# EasyEDA Pro project ProPrj_Anniversary_2026-05-06.epro, board PCB1
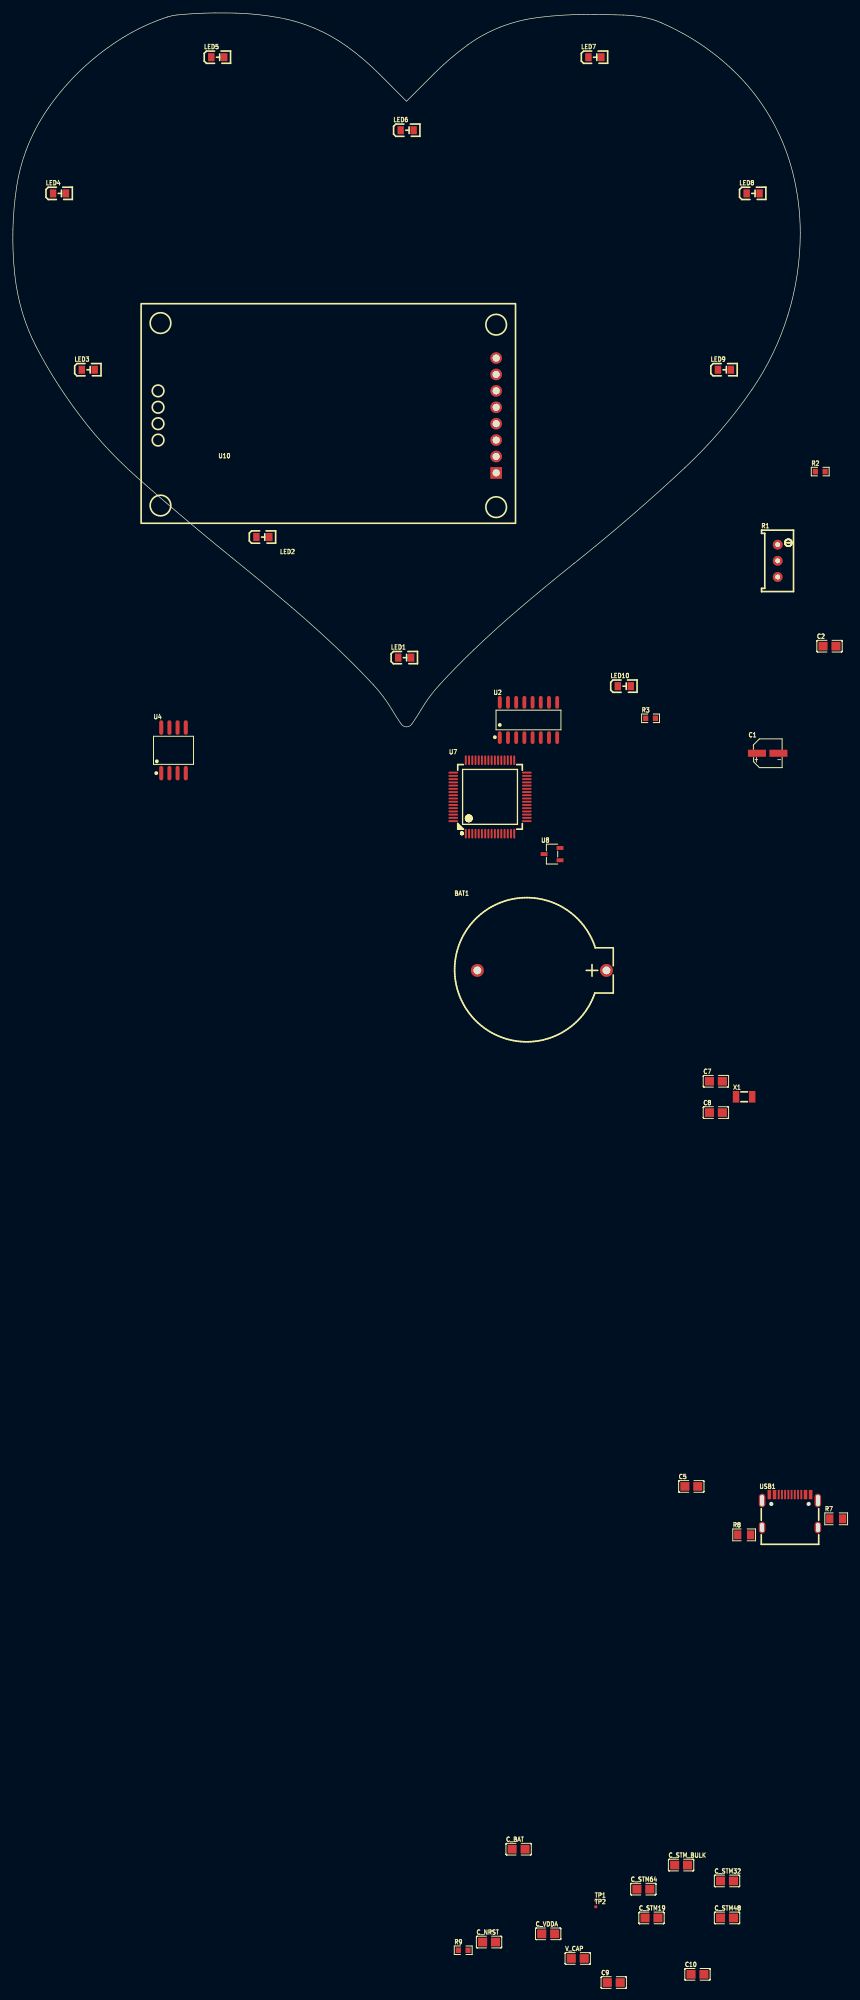
[diagram p5: board, top side]
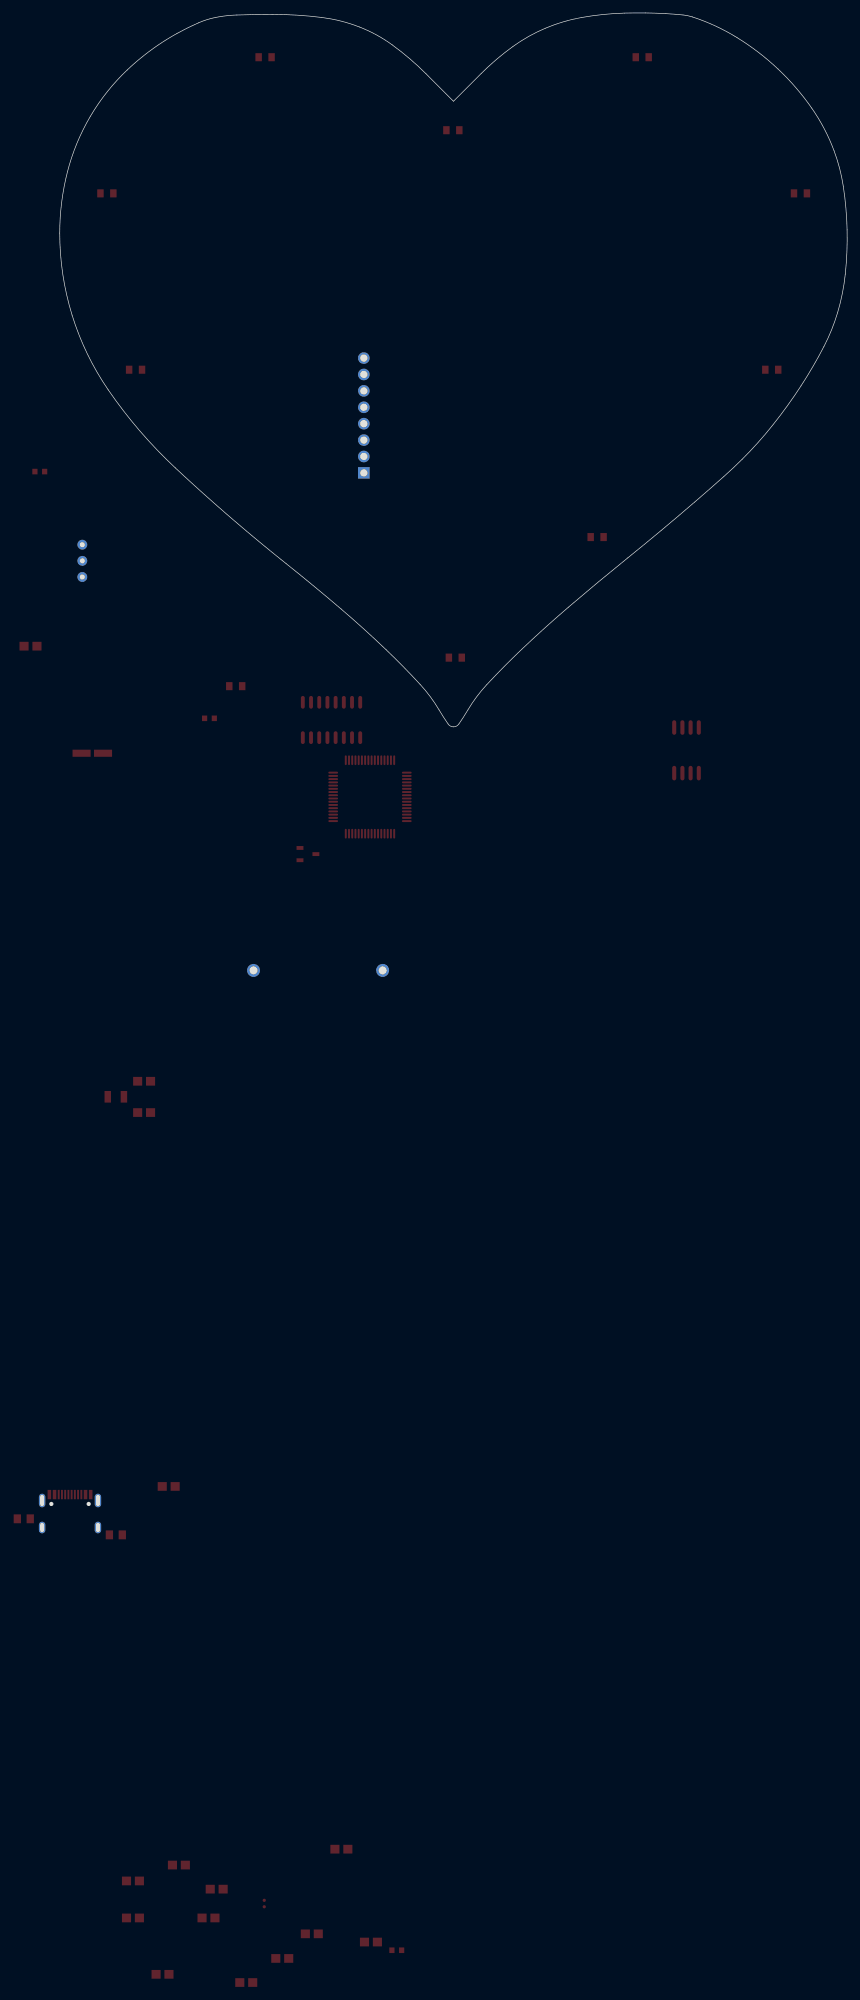
[diagram p6: board, bottom side, seen from below]

Outline 123.59 x 231.18 mm; copper layers: Top Layer, Bottom Layer. Coordinates in mm from the lower left corner of the outline.
Outline path: 0,197.58 arc(0.18,200.95) 0.58,204.31 arc(1.16,207.12) 2.03,209.86 arc(3.55,213.26) 5.49,216.45 arc(7.93,219.6) 10.69,222.48 arc(13.75,225.09) 17.06,227.36 arc(20.42,229.17) 23.97,230.56 arc(24.69,230.75) 25.42,230.86 arc(26.75,230.98) 28.09,231.06 arc(29.66,231.14) 31.23,231.17 arc(32.85,231.18) 34.47,231.15 arc(37.81,230.93) 41.13,230.46 arc(43.98,229.79) 46.73,228.81 arc(49.33,227.53) 51.76,225.98 arc(54.31,223.97) 56.7,221.77 60.97,217.5 65.25,221.77 arc(67.77,224.11) 70.47,226.23 arc(72.93,227.78) 75.56,229 arc(78.44,229.92) 81.4,230.47 arc(85.18,230.83) 88.97,230.94 arc(91.79,230.92) 94.61,230.85 arc(96.22,230.73) 97.82,230.48 arc(99.17,230.13) 100.48,229.64 arc(102.17,228.85) 103.82,227.98 arc(107.85,225.41) 111.52,222.34 arc(114.64,218.93) 117.25,215.12 arc(119.31,210.98) 120.77,206.59 arc(121.67,201.88) 121.97,197.09 arc(121.49,190.67) 120.06,184.39 arc(117.71,178.41) 114.49,172.86 arc(109.62,166.52) 104.09,160.75 arc(95.64,153.17) 86.9,145.92 arc(82.61,142.43) 78.37,138.88 arc(74.85,135.78) 71.41,132.58 arc(68.74,129.94) 66.15,127.22 arc(64.57,125.31) 63.2,123.25 arc(62.52,122.15) 61.8,121.07 arc(61.44,120.75) 60.98,120.64 arc(60.51,120.75) 60.15,121.07 arc(59.43,122.14) 58.76,123.23 arc(57.4,125.28) 55.82,127.16 arc(53.17,129.93) 50.44,132.61 arc(46.85,135.93) 43.17,139.16 arc(38.6,143.01) 33.97,146.8 arc(31.38,148.91) 28.81,151.03 arc(26.21,153.22) 23.62,155.43 arc(21.35,157.4) 19.09,159.39 arc(17.67,160.7) 16.28,162.04 arc(13.84,164.61) 11.55,167.32 arc(9.27,170.31) 7.15,173.41 arc(5.29,176.43) 3.59,179.53 arc(2.4,182.11) 1.46,184.8 arc(0.73,187.74) 0.28,190.73 arc(0.03,194.15) 0,197.58
Stack: Top Layer 0.035mm / Dielectric1 1.51mm FR4 er 4.5 / Bottom Layer 0.035mm

## Design rules (mm)
template: JLCPCB Capability(Two Layers Board)
spacing copperThickness1oz (default): track to track 0.102, other pairs 0.152 to 0.3
spacing copperThickness2oz: track to track 0.203, other pairs 0.152 to 0.3
track width copperThickness1oz (default): min 0.127, default 0.254, max 2.54
track width copperThickness2oz: min 0.203, default 0.254, max 2.54
differential pair differentialPair (default): width min 0.127, default 0.254, max 2.54; gap min 0.152, default 0.152
via viaSize (default): diameter min 0.5, default 0.61, max 10; hole min 0.3, default 0.305, max 6.3

## Placement (name value [footprint] x y rotation side)
BAT1  KH-CR2032-2-1  [BAT-TH_KH-CR2032-2-1]  81.95 82.93 0 top
C1  1uF  [CAP-SMD_BD4.0-L4.3-W4.3-FD]  116.93 116.55 0 top
C2  10nF  [C0805]  126.5 133.13 0 top
C5  4.7uF  [C0805]  105.09 3.03 0 top
C7  22pF  [C0805]  108.9 65.77 0 top
C8  22pF  [C0805]  108.9 60.92 0 top
C9  1uF  [C0805]  93.08 -73.78 0 top
C10  1uF  [C0805]  106.05 -72.51 0 top
C_BAT  100nF  [C0805]  78.34 -53.13 0 top
C_NRST  100nF  [C0805]  73.76 -67.51 0 top
C_STM19  100nF  [C0805]  98.93 -63.78 0 top
C_STM32  100nF  [C0805]  110.63 -58.05 0 top
C_STM48  100nF  [C0805]  110.63 -63.78 0 top
C_STM64  100nF  [C0805]  97.66 -59.32 0 top
C_STM_BULK  4.7uF  [C0805]  103.51 -55.59 0 top
C_VDDA  100nF  [C0805]  82.92 -66.24 0 top
LED1  XL-2012SURC  [LED0805-RD_RED]  60.69 131.35 0 top
LED2  XL-2012SURC  [LED0805-RD_RED]  38.72 150.02 0 top
LED3  XL-2012SURC  [LED0805-RD_RED]  11.67 175.93 0 top
LED4  XL-2012SURC  [LED0805-RD_RED]  7.22 203.24 0 top
LED5  XL-2012SURC  [LED0805-RD_RED]  31.74 224.32 0 top
LED6  XL-2012SURC  [LED0805-RD_RED]  61.07 213.02 0 top
LED7  XL-2012SURC  [LED0805-RD_RED]  90.16 224.32 0 top
LED8  XL-2012SURC  [LED0805-RD_RED]  114.67 203.24 0 top
LED9  XL-2012SURC  [LED0805-RD_RED]  110.22 175.93 0 top
LED10  XL-2012SURC  [LED0805-RD_RED]  94.71 126.94 0 top
R1  50kΩ  [RES-ADJ-TH_3P-L9.5-W4.85-P2.50-BL-BS]  118.48 146.34 0 top
R2  1k  [R0603]  125.07 160.16 0 top
R3  470  [R0603]  98.78 121.96 0 top
R7  5.1K  [R0805]  127.54 -1.98 0 top
R8  5.1K  [R0805]  113.28 -4.47 0 top
R9  10K  [R0603]  69.76 -68.78 0 top
TP1  -  [Test-Point-0.5mm]  90.29 -61.05 0 top
TP2  -  [Test-Point-0.5mm]  90.29 -62.05 0 top
U2  CD4017BM96  [SOIC-16_L9.9-W3.9-P1.27-LS6.0-BL]  79.87 121.7 0 top
U4  NE555PSR  [SOIC-8_L6.2-W5.3-P1.27-LS8.0-BL]  24.88 117 0 top
U7  STM32F411RET6  [LQFP-64_L10.0-W10.0-P0.50-LS12.0-BL]  73.91 109.78 0 top
U8  TPMCP1700T-3302E/TT  [SOT-23-3_L2.9-W1.6-P1.90-LS2.8-BR]  83.52 100.94 0 top
U10  -  [1.8 TFT SPI 128x160 ST7735S with CardReader]  31.86 198.16 0 top
USB1  HYCW498-USBC16-735B  [USB-C-SMD_HYCW498-USBC16-735B]  120.38 -0.78 0 top
V_CAP  4.7uF  [C0805]  87.5 -70.05 0 top
X1  32.768kHz  [FC-135R_L3.2-W1.5]  113.28 63.36 0 top

## Footprints (pads in the part's own frame, mm; a bottom-side part is the same pattern mirrored in y, then rotated)
1.8 TFT SPI 128x160 ST7735S with CardReader
  rect 1.8x1.8 hole 1.1: 1(43,-38.2)
  round 1.8 hole 1.1: 2(43,-35.66) 3(43,-33.12) 4(43,-30.58) 5(43,-28.04) 6(43,-25.5) 7(43,-22.96) 8(43,-20.42)
BAT-TH_KH-CR2032-2-1
  round 2 hole 1.2: 1(10,0) 2(-10,0)
C0805
  rect 1.41x1.35 smd: 1(-1,0) 2(1,0)
CAP-SMD_BD4.0-L4.3-W4.3-FD
  rect 2.8x1.1 smd: 1(-1.661,0) 2(1.661,0)
FC-135R_L3.2-W1.5
  rect 1x1.8 smd: 1(-1.25,0) 2(1.25,0)
LED0805-RD_RED
  rect 1x1.25 smd: 1(-1,0) 2(1,0)
LQFP-64_L10.0-W10.0-P0.50-LS12.0-BL
  oval 0.3x1.5 smd: 1(-3.75,-5.688) 2(-3.25,-5.688) 3(-2.75,-5.688) 4(-2.25,-5.688) 5(-1.75,-5.688) 6(-1.25,-5.688) 7(-0.75,-5.688) 8(-0.25,-5.688) 9(0.25,-5.688) 10(0.75,-5.688) 11(1.25,-5.688) 12(1.75,-5.688) 13(2.25,-5.688) 14(2.75,-5.688) 15(3.25,-5.688) 16(3.75,-5.688) 33(3.75,5.688) 34(3.25,5.688) 35(2.75,5.688) 36(2.25,5.688) 37(1.75,5.688) 38(1.25,5.688) 39(0.75,5.688) 40(0.25,5.688) 41(-0.25,5.688) 42(-0.75,5.688) 43(-1.25,5.688) 44(-1.75,5.688) 45(-2.25,5.688) 46(-2.75,5.688) 47(-3.25,5.688) 48(-3.75,5.688)
  oval 1.5x0.3 smd: 17(5.7,-3.738) 18(5.7,-3.238) 19(5.7,-2.738) 20(5.7,-2.238) 21(5.7,-1.738) 22(5.7,-1.238) 23(5.7,-0.739) 24(5.7,-0.238) 25(5.7,0.262) 26(5.7,0.762) 27(5.7,1.262) 28(5.7,1.762) 29(5.7,2.261) 30(5.7,2.762) 31(5.7,3.261) 32(5.7,3.762) 49(-5.7,3.762) 50(-5.7,3.261) 51(-5.7,2.762) 52(-5.7,2.261) 53(-5.7,1.762) 54(-5.7,1.262) 55(-5.7,0.762) 56(-5.7,0.262) 57(-5.7,-0.238) 58(-5.7,-0.739) 59(-5.7,-1.238) 60(-5.7,-1.738) 61(-5.7,-2.238) 62(-5.7,-2.738) 63(-5.7,-3.238) 64(-5.7,-3.738)
R0603
  rect 0.806x0.864 smd: 1(-0.753,0) 2(0.753,0)
R0805
  rect 1.133x1.377 smd: 1(-1,0) 2(1,0)
RES-ADJ-TH_3P-L9.5-W4.85-P2.50-BL-BS
  round 1.524 hole 0.762: 1(0,2.5) 2(0,0) 3(0,-2.5)
SOIC-8_L6.2-W5.3-P1.27-LS8.0-BL
  oval 0.63x2.25 smd: 1(-1.905,-3.53) 2(-0.635,-3.53) 3(0.635,-3.53) 4(1.905,-3.53) 5(1.905,3.53) 6(0.635,3.53) 7(-0.635,3.53) 8(-1.905,3.53)
SOIC-16_L9.9-W3.9-P1.27-LS6.0-BL
  oval 0.602x1.971 smd: 1(-4.445,-2.736) 2(-3.175,-2.736) 3(-1.905,-2.736) 4(-0.635,-2.736) 5(0.635,-2.736) 6(1.905,-2.736) 7(3.175,-2.736) 8(4.445,-2.736) 9(4.445,2.736) 10(3.175,2.736) 11(1.905,2.736) 12(0.635,2.736) 13(-0.635,2.736) 14(-1.905,2.736) 15(-3.175,2.736) 16(-4.445,2.736)
SOT-23-3_L2.9-W1.6-P1.90-LS2.8-BR
  rect 1.07x0.6 smd: 1(1.235,-0.95) 2(1.235,0.95) 3(-1.235,0)
Test-Point-0.5mm
  round 0.5 smd: 1(0,0)
USB-C-SMD_HYCW498-USBC16-735B
  oval 1x2.1 hole 0.6x1.7: 1(-4.32,1.63) 2(4.32,1.63)
  oval 1x1.8 hole 0.6x1.4: 3(-4.32,-2.55) 4(4.32,-2.55)
  rect 0.55x1.45 smd: A1B12(-3.2,2.55) A4B9(-2.4,2.55) B1A12(3.2,2.55) B4A9(2.4,2.55)
  rect 0.3x1.45 smd: A5(-1.25,2.55) A6(-0.25,2.55) A7(0.25,2.55) A8(1.25,2.55) B5(1.75,2.55) B6(0.75,2.55) B7(-0.75,2.55) B8(-1.75,2.55)

## Nets
As in the schematic.

Pads without a net: U2 12; U7 2 5 6 8 9 10 11 14 15 22 24 25 26 27 28 29 33 36 37 38 39 40 41 42 43 44 45 46 49 50 51 52 53 54 55 56 57 58 59 61 62; USB1 1 2 3 4 A6 A7 A8 B6 B7 B8
